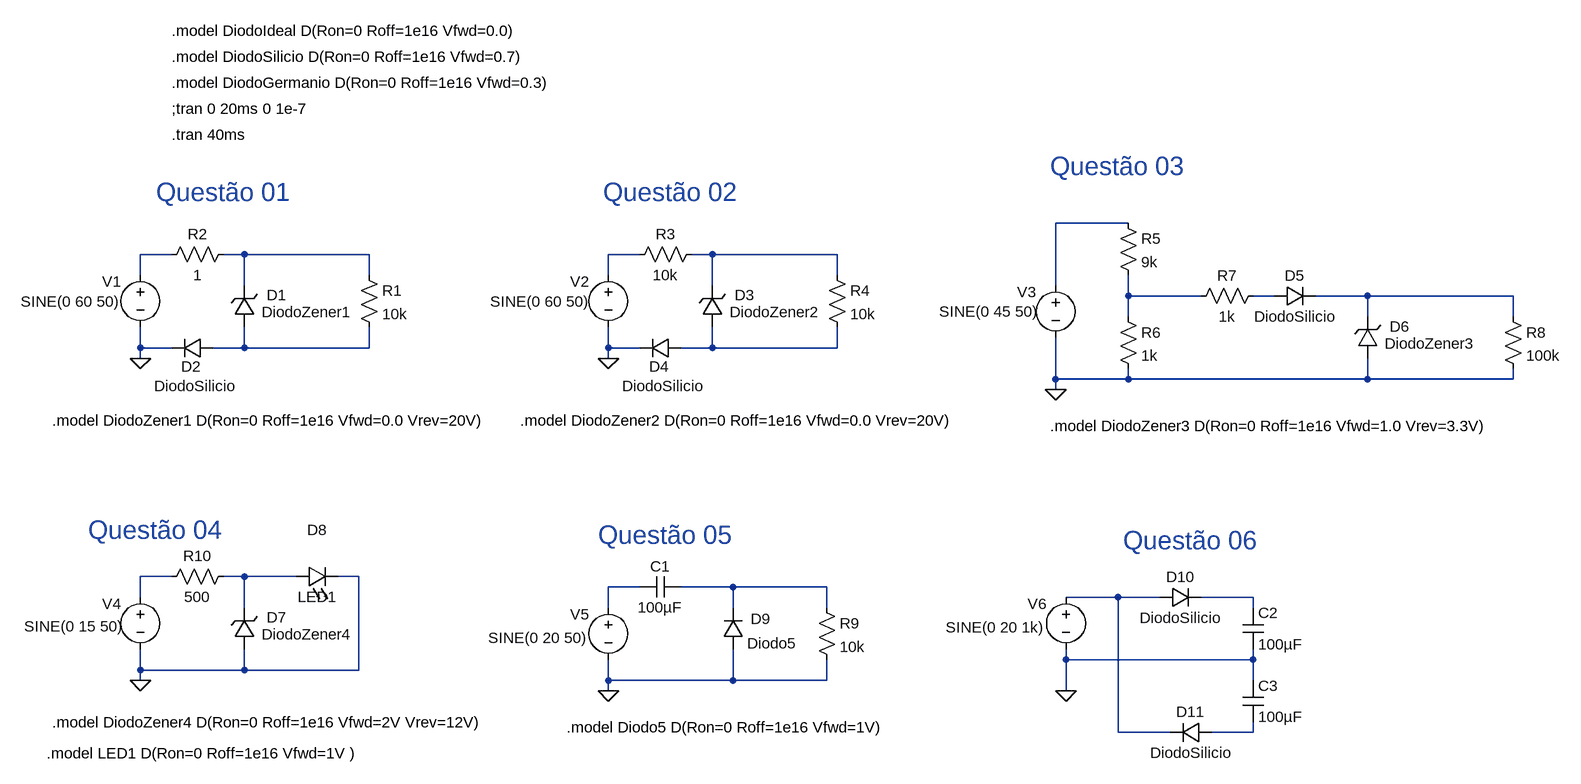
[diagram p0: schematic P1A11-Circuitos4-LTSpice.asc]
P1A11-Circuitos4-LTSpice.asc, the LTspice schematic file:
Version 4
SHEET 1 2300 1300
WIRE 1440 -32 1328 -32
WIRE -32 16 -80 16
WIRE 80 16 48 16
WIRE 272 16 80 16
WIRE 688 16 640 16
WIRE 800 16 768 16
WIRE 992 16 800 16
WIRE -80 48 -80 16
WIRE 272 48 272 16
WIRE 640 48 640 16
WIRE 992 48 992 16
WIRE 80 64 80 16
WIRE 800 64 800 16
WIRE 1328 64 1328 -32
WIRE 1440 80 1440 48
WIRE 1552 80 1440 80
WIRE 1664 80 1632 80
WIRE 1808 80 1728 80
WIRE 2032 80 1808 80
WIRE 1440 112 1440 80
WIRE 1808 112 1808 80
WIRE 2032 112 2032 80
WIRE -80 160 -80 128
WIRE -32 160 -80 160
WIRE 80 160 80 128
WIRE 80 160 32 160
WIRE 272 160 272 128
WIRE 272 160 80 160
WIRE 640 160 640 128
WIRE 688 160 640 160
WIRE 800 160 800 128
WIRE 800 160 752 160
WIRE 992 160 992 128
WIRE 992 160 800 160
WIRE -80 176 -80 160
WIRE 640 176 640 160
WIRE 1328 208 1328 144
WIRE 1440 208 1440 192
WIRE 1440 208 1328 208
WIRE 1808 208 1808 176
WIRE 1808 208 1440 208
WIRE 2032 208 2032 192
WIRE 2032 208 1808 208
WIRE 1328 224 1328 208
WIRE -32 512 -80 512
WIRE 80 512 48 512
WIRE 160 512 80 512
WIRE 256 512 224 512
WIRE 688 528 640 528
WIRE 832 528 752 528
WIRE 976 528 832 528
WIRE -80 544 -80 512
WIRE 1424 544 1344 544
WIRE 1488 544 1424 544
WIRE 1632 544 1552 544
WIRE 80 560 80 512
WIRE 640 560 640 528
WIRE 832 560 832 528
WIRE 976 560 976 528
WIRE 1632 560 1632 544
WIRE 1344 640 1344 624
WIRE 1632 640 1632 624
WIRE 1632 640 1344 640
WIRE -80 656 -80 624
WIRE 80 656 80 624
WIRE 80 656 -80 656
WIRE 256 656 256 512
WIRE 256 656 80 656
WIRE -80 672 -80 656
WIRE 640 672 640 640
WIRE 832 672 832 624
WIRE 832 672 640 672
WIRE 976 672 976 640
WIRE 976 672 832 672
WIRE 1632 672 1632 640
WIRE 640 688 640 672
WIRE 1344 688 1344 640
WIRE 1424 752 1424 544
WIRE 1504 752 1424 752
WIRE 1632 752 1632 736
WIRE 1632 752 1568 752
FLAG -80 176 0
FLAG 640 176 0
FLAG 1328 224 0
FLAG -80 672 0
FLAG 640 688 0
FLAG 1344 688 0
SYMBOL voltage -80 32 R0
WINDOW 123 0 0 Left 2
WINDOW 39 0 0 Left 2
WINDOW 0 -59 26 Left 2
WINDOW 3 -184 57 Left 2
SYMATTR InstName V1
SYMATTR Value SINE(0 60 50)
SYMBOL res 256 32 R0
SYMATTR InstName R1
SYMATTR Value 10k
SYMBOL res -48 32 R270
WINDOW 0 32 56 VTop 2
WINDOW 3 0 56 VBottom 2
SYMATTR InstName R2
SYMATTR Value 1
SYMBOL zener 96 128 R180
WINDOW 0 -49 49 Left 2
WINDOW 3 -151 23 Left 2
SYMATTR InstName D1
SYMATTR Value DiodoZener1
SYMBOL res 1536 96 R270
WINDOW 0 32 56 VTop 2
WINDOW 3 0 56 VBottom 2
SYMATTR InstName R7
SYMATTR Value 1k
SYMBOL diode 32 144 R90
WINDOW 0 60 34 VBottom 2
WINDOW 3 59 28 VTop 2
SYMATTR InstName D2
SYMATTR Value DiodoSilicio
SYMBOL voltage 640 32 R0
WINDOW 123 0 0 Left 2
WINDOW 39 0 0 Left 2
WINDOW 0 -59 26 Left 2
WINDOW 3 -182 57 Left 2
SYMATTR InstName V2
SYMATTR Value SINE(0 60 50)
SYMBOL res 976 32 R0
SYMATTR InstName R4
SYMATTR Value 10k
SYMBOL res 672 32 R270
WINDOW 0 32 56 VTop 2
WINDOW 3 0 56 VBottom 2
SYMATTR InstName R3
SYMATTR Value 10k
SYMBOL zener 816 128 R180
WINDOW 0 -49 49 Left 2
WINDOW 3 -151 23 Left 2
SYMATTR InstName D3
SYMATTR Value DiodoZener2
SYMBOL diode 752 144 R90
WINDOW 0 60 34 VBottom 2
WINDOW 3 59 28 VTop 2
SYMATTR InstName D4
SYMATTR Value DiodoSilicio
SYMBOL voltage 1328 48 R0
WINDOW 123 0 0 Left 2
WINDOW 39 0 0 Left 2
WINDOW 0 -59 26 Left 2
WINDOW 3 -179 56 Left 2
SYMATTR InstName V3
SYMATTR Value SINE(0 45 50)
SYMBOL res 1424 -48 R0
SYMATTR InstName R5
SYMATTR Value 9k
SYMBOL res 1424 96 R0
SYMATTR InstName R6
SYMATTR Value 1k
SYMBOL diode 1664 96 R270
WINDOW 0 32 32 VTop 2
WINDOW 3 0 32 VBottom 2
SYMATTR InstName D5
SYMATTR Value DiodoSilicio
SYMBOL zener 1824 176 R180
WINDOW 0 -49 49 Left 2
WINDOW 3 -151 23 Left 2
SYMATTR InstName D6
SYMATTR Value DiodoZener3
SYMBOL res 2016 96 R0
SYMATTR InstName R8
SYMATTR Value 100k
SYMBOL voltage -80 528 R0
WINDOW 123 0 0 Left 2
WINDOW 39 0 0 Left 2
WINDOW 0 -59 26 Left 2
WINDOW 3 -179 61 Left 2
SYMATTR InstName V4
SYMATTR Value SINE(0 15 50)
SYMBOL res -48 528 R270
WINDOW 0 32 56 VTop 2
WINDOW 3 0 56 VBottom 2
SYMATTR InstName R10
SYMATTR Value 500
SYMBOL zener 96 624 R180
WINDOW 0 -49 49 Left 2
WINDOW 3 -151 23 Left 2
SYMATTR InstName D7
SYMATTR Value DiodoZener4
SYMBOL LED 160 528 R270
WINDOW 0 72 32 VTop 2
WINDOW 3 0 32 VBottom 2
SYMATTR InstName D8
SYMATTR Value LED1
SYMBOL voltage 640 544 R0
WINDOW 123 0 0 Left 2
WINDOW 39 0 0 Left 2
WINDOW 0 -59 26 Left 2
WINDOW 3 -185 62 Left 2
SYMATTR InstName V5
SYMATTR Value SINE(0 20 50)
SYMBOL cap 688 544 R270
WINDOW 0 32 32 VTop 2
WINDOW 3 0 32 VBottom 2
SYMATTR InstName C1
SYMATTR Value 100µF
SYMBOL diode 848 624 R180
WINDOW 0 -42 47 Left 2
WINDOW 3 -82 9 Left 2
SYMATTR InstName D9
SYMATTR Value Diodo5
SYMBOL res 960 544 R0
SYMATTR InstName R9
SYMATTR Value 10k
SYMBOL voltage 1344 528 R0
WINDOW 123 0 0 Left 2
WINDOW 39 0 0 Left 2
WINDOW 0 -59 26 Left 2
WINDOW 3 -185 62 Left 2
SYMATTR InstName V6
SYMATTR Value SINE(0 20 1k)
SYMBOL diode 1488 560 R270
WINDOW 0 32 32 VTop 2
WINDOW 3 0 32 VBottom 2
SYMATTR InstName D10
SYMATTR Value DiodoSilicio
SYMBOL diode 1568 736 R90
WINDOW 0 0 32 VBottom 2
WINDOW 3 32 32 VTop 2
SYMATTR InstName D11
SYMATTR Value DiodoSilicio
SYMBOL cap 1616 560 R0
SYMATTR InstName C2
SYMATTR Value 100µF
SYMBOL cap 1616 672 R0
SYMATTR InstName C3
SYMATTR Value 100µF
TEXT -32 -208 Left 2 !;tran 0 20ms 0 1e-7
TEXT -32 -328 Left 2 !.model DiodoIdeal D(Ron=0 Roff=1e16 Vfwd=0.0)
TEXT -32 -288 Left 2 !.model DiodoSilicio D(Ron=0 Roff=1e16 Vfwd=0.7)
TEXT -56 -80 Left 4 ;Questão 01
TEXT -216 272 Left 2 !.model DiodoZener1 D(Ron=0 Roff=1e16 Vfwd=0.0 Vrev=20V)
TEXT -32 -248 Left 2 !.model DiodoGermanio D(Ron=0 Roff=1e16 Vfwd=0.3)
TEXT 632 -80 Left 4 ;Questão 02
TEXT 1320 -120 Left 4 ;Questão 03
TEXT -160 440 Left 4 ;Questão 04
TEXT 624 448 Left 4 ;Questão 05
TEXT 1432 456 Left 4 ;Questão 06
TEXT 504 272 Left 2 !.model DiodoZener2 D(Ron=0 Roff=1e16 Vfwd=0.0 Vrev=20V)
TEXT 1320 280 Left 2 !.model DiodoZener3 D(Ron=0 Roff=1e16 Vfwd=1.0 Vrev=3.3V)
TEXT -216 736 Left 2 !.model DiodoZener4 D(Ron=0 Roff=1e16 Vfwd=2V Vrev=12V)
TEXT -224 784 Left 2 !.model LED1 D(Ron=0 Roff=1e16 Vfwd=1V )
TEXT 576 744 Left 2 !.model Diodo5 D(Ron=0 Roff=1e16 Vfwd=1V)
TEXT -32 -168 Left 2 !.tran 40ms

The netlist it stands for:
* P1A11-Circuitos4-LTSpice.asc
V1 N002 0 SINE(0 60 50)
R1 N003 N009 10k
R2 N002 N003 1
D1 N009 N003 DiodoZener1
R7 N006 N007 1k
D2 N009 0 DiodoSilicio
V2 N004 0 SINE(0 60 50)
R4 N005 N010 10k
R3 N004 N005 10k
D3 N010 N005 DiodoZener2
D4 N010 0 DiodoSilicio
V3 N001 0 SINE(0 45 50)
R5 N001 N006 9k
R6 N006 0 1k
D5 N007 N008 DiodoSilicio
D6 0 N008 DiodoZener3
R8 N008 0 100k
V4 N011 0 SINE(0 15 50)
R10 N011 N012 500
D7 0 N012 DiodoZener4
D8 N012 0 LED1
V5 N013 0 SINE(0 20 50)
C1 N013 N014 100µF
D9 0 N014 Diodo5
R9 N014 0 10k
V6 N015 0 SINE(0 20 1k)
D10 N015 N016 DiodoSilicio
D11 N017 N015 DiodoSilicio
C2 N016 0 100µF
C3 0 N017 100µF
.model D D
.lib standard.dio
;tran 0 20ms 0 1e-7
.model DiodoIdeal D(Ron=0 Roff=1e16 Vfwd=0.0)
.model DiodoSilicio D(Ron=0 Roff=1e16 Vfwd=0.7)
* Questão 01
.model DiodoZener1 D(Ron=0 Roff=1e16 Vfwd=0.0 Vrev=20V)
.model DiodoGermanio D(Ron=0 Roff=1e16 Vfwd=0.3)
* Questão 02
* Questão 03
* Questão 04
* Questão 05
* Questão 06
.model DiodoZener2 D(Ron=0 Roff=1e16 Vfwd=0.0 Vrev=20V)
.model DiodoZener3 D(Ron=0 Roff=1e16 Vfwd=1.0 Vrev=3.3V)
.model DiodoZener4 D(Ron=0 Roff=1e16 Vfwd=2V Vrev=12V)
.model LED1 D(Ron=0 Roff=1e16 Vfwd=1V )
.model Diodo5 D(Ron=0 Roff=1e16 Vfwd=1V)
.tran 40ms
.backanno
.end